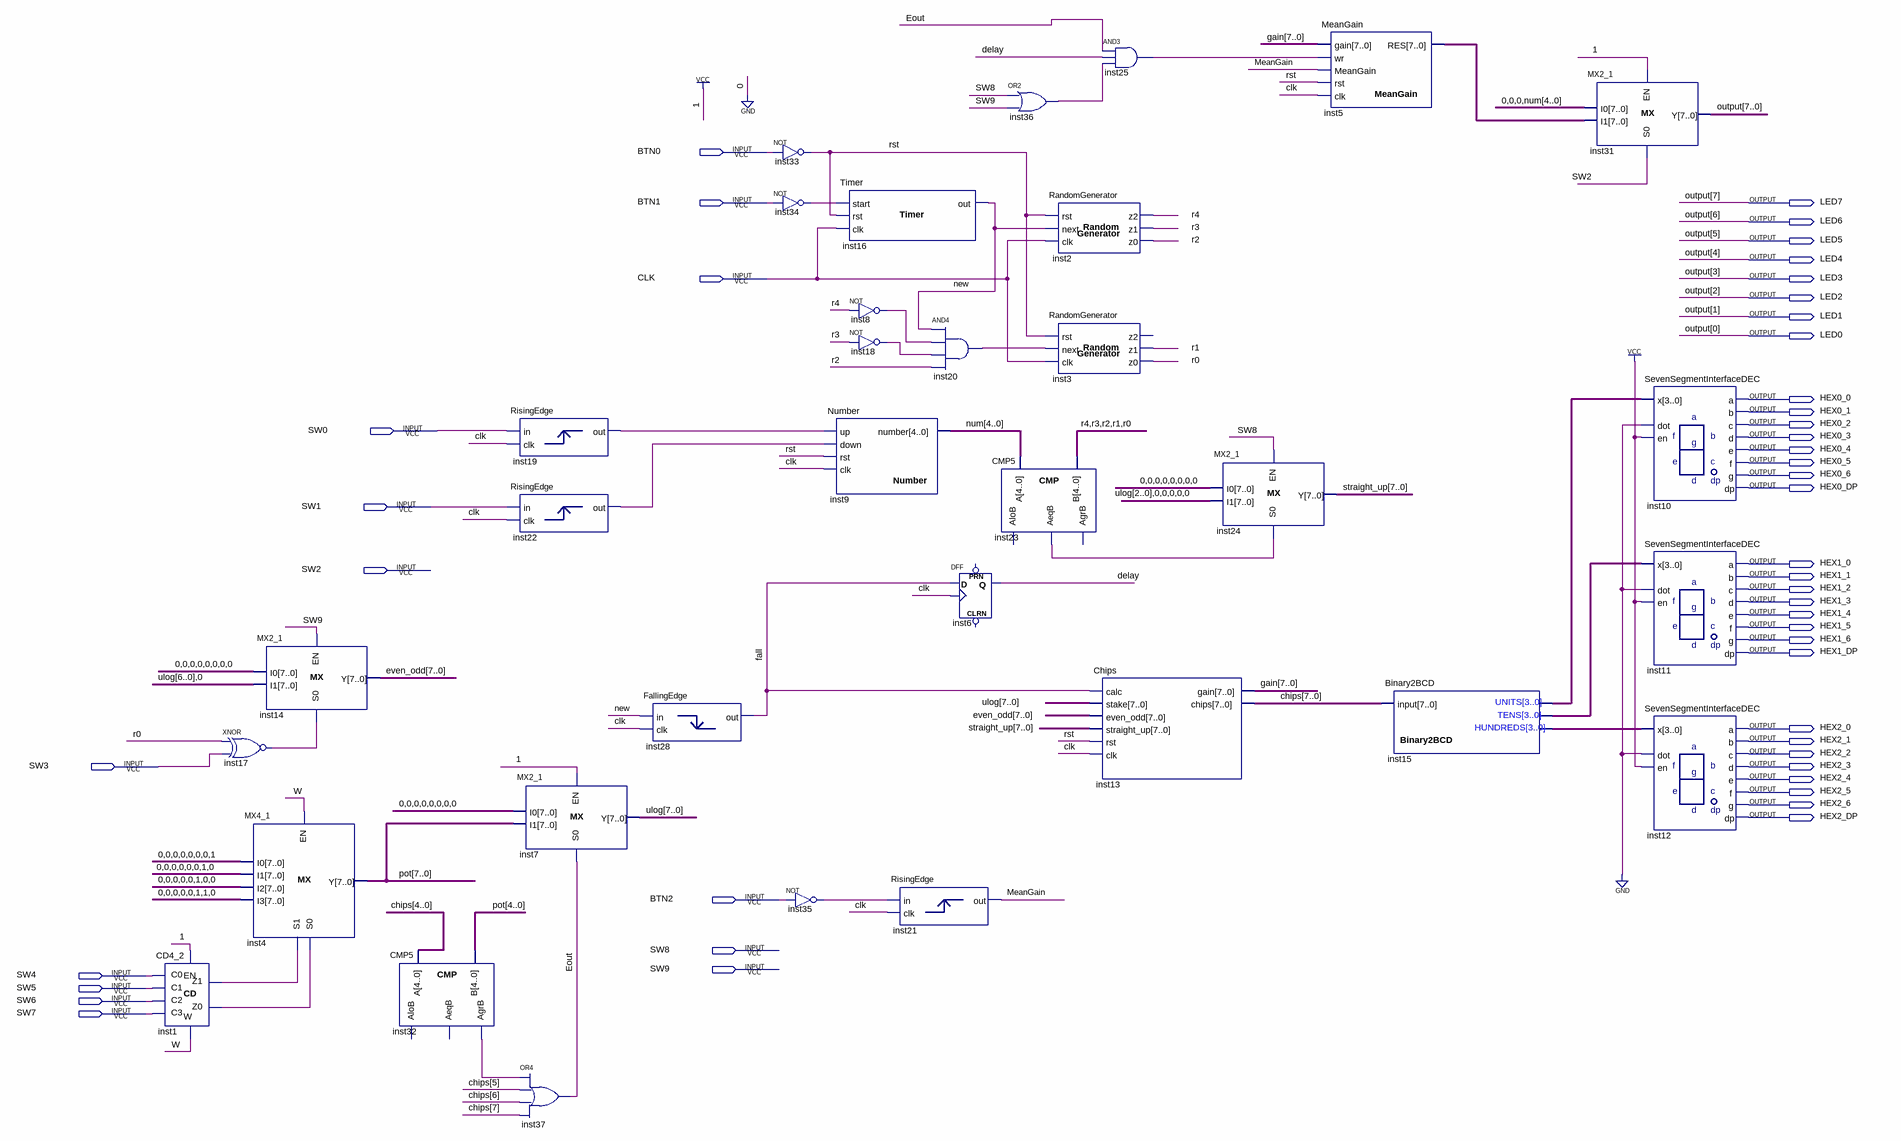
[diagram p0: schematic sheet]
// Quartus schematic PORT_LAB5.bdf as structural Verilog: 33 symbols, 46 pins
module PORT_LAB5 (
  input  BTN0,
  input  BTN1,
  input  CLK,
  input  SW0,
  input  SW1,
  input  SW2,
  input  SW3,
  input  BTN2,
  input  SW8,
  input  SW9,
  input  SW4,
  input  SW5,
  input  SW6,
  input  SW7,
  output LED7,
  output LED6,
  output LED5,
  output LED4,
  output LED3,
  output LED2,
  output LED1,
  output LED0,
  output HEX0_0,
  output HEX0_1,
  output HEX0_2,
  output HEX0_3,
  output HEX0_4,
  output HEX0_5,
  output HEX0_6,
  output HEX0_DP,
  output HEX1_0,
  output HEX1_1,
  output HEX1_2,
  output HEX1_3,
  output HEX1_4,
  output HEX1_5,
  output HEX1_6,
  output HEX1_DP,
  output HEX2_0,
  output HEX2_1,
  output HEX2_2,
  output HEX2_3,
  output HEX2_4,
  output HEX2_5,
  output HEX2_6,
  output HEX2_DP
);

  wire delay, Eout, fall, inst1_z0, inst1_z1, inst8_out, inst17_out, inst18_out, inst19_output, inst20_out,
       inst22_output, inst23_aeqb, inst25_out, inst32_agrb, inst34_out, inst35_out, inst36_out, MeanGain,
       \new , r0, r1, r2, r3, r4, rst, W;
  wire [3:0] inst15_bcd_hundreds, inst15_bcd_tens, inst15_bcd_units;
  wire [4:0] num;
  wire [7:0] chips, even_odd, gain, inst5_res, pot, straight_up, ulog;

  CD4_2 inst1 (.C0(SW4), .C1(SW5), .C2(SW6), .C3(SW7), .EN(1'b1), .Z0(inst1_z0), .Z1(inst1_z1), .W(W));
  xnor inst17 (inst17_out, r0, SW3);
  MX2_1 inst14 (.I1({ulog[6:0], 1'b0}), .I0({8{1'b0}}), .S0(inst17_out), .EN(SW9), .Y(even_odd));
  MX4_1 inst4 (
    .I3(8'b00000110), .I2(8'b00000100), .I1(8'b00000010), .I0(8'b00000001), .S1(inst1_z1), .S0(inst1_z0),
    .EN(W), .Y(pot));
  CMP5 inst32 (.A(chips[4:0]), .B(pot[4:0]), .AgrB(inst32_agrb));  // open: AeqB, AloB
  RisingEdge inst19 (.clk(CLK), .\input (SW0), .\output (inst19_output));
  RisingEdge inst22 (.clk(CLK), .\input (SW1), .\output (inst22_output));
  MX2_1 inst7 (.I1(pot), .I0({8{1'b0}}), .S0(Eout), .EN(1'b1), .Y(ulog));
  or inst37 (Eout, inst32_agrb, chips[5], chips[6], chips[7]);
  FallingEdge inst28 (.clk(CLK), .\input (\new ), .\output (fall));
  not inst33 (rst, BTN0);
  not inst34 (inst34_out, BTN1);
  not inst35 (inst35_out, BTN2);
  Timer inst16 (.start(inst34_out), .rst(rst), .clk(CLK), .out(\new ));
  Number inst9 (.up(inst19_output), .down(inst22_output), .rst(rst), .clk(CLK), .number(num));
  not inst8 (inst8_out, r4);
  not inst18 (inst18_out, r3);
  RisingEdge inst21 (.clk(CLK), .\input (inst35_out), .\output (MeanGain));
  and inst20 (inst20_out, \new , inst8_out, inst18_out, r2);
  CMP5 inst23 (.A(num), .B({r4, r3, r2, r1, r0}), .AeqB(inst23_aeqb));  // open: AgrB, AloB
  DFF inst6 (.CLK(CLK), .D(fall), .Q(delay));  // open: CLRN, PRN
  or inst36 (inst36_out, SW8, SW9);
  RandomGenerator inst2 (.NXT(\new ), .RST(rst), .CLK(CLK), .Z2(r4), .Z1(r3), .Z0(r2));
  RandomGenerator inst3 (.NXT(inst20_out), .RST(rst), .CLK(CLK), .Z1(r1), .Z0(r0));  // open: Z2
  Chips inst13 (
    .calc(fall), .stake(ulog), .even_odd(even_odd), .straight_up(straight_up), .rst(rst), .clk(CLK),
    .gain(gain), .chips(chips));
  and inst25 (inst25_out, Eout, delay, inst36_out);
  MX2_1 inst24 (.I1({ulog[2:0], {5{1'b0}}}), .I0({8{1'b0}}), .S0(inst23_aeqb), .EN(SW8), .Y(straight_up));
  MeanGain inst5 (.gain(gain), .wr(inst25_out), .MeanGain(MeanGain), .rst(rst), .clk(CLK), .RES(inst5_res));
  Binary2BCD inst15 (
    .\input (chips), .bcd_hundreds(inst15_bcd_hundreds), .bcd_tens(inst15_bcd_tens),
    .bcd_units(inst15_bcd_units));
  MX2_1 inst31 (
    .I1(inst5_res), .I0({3'b000, num}), .S0(SW2), .EN(1'b1),
    .Y({LED7, LED6, LED5, LED4, LED3, LED2, LED1, LED0}));
  SevenSegmentInterfaceDEC inst10 (
    .dot(1'b0), .en(1'b1), .x(inst15_bcd_units), .a(HEX0_0), .b(HEX0_1), .c(HEX0_2), .d(HEX0_3), .e(HEX0_4),
    .f(HEX0_5), .g(HEX0_6), .dp(HEX0_DP));
  SevenSegmentInterfaceDEC inst11 (
    .dot(1'b0), .en(1'b1), .x(inst15_bcd_tens), .a(HEX1_0), .b(HEX1_1), .c(HEX1_2), .d(HEX1_3), .e(HEX1_4),
    .f(HEX1_5), .g(HEX1_6), .dp(HEX1_DP));
  SevenSegmentInterfaceDEC inst12 (
    .dot(1'b0), .en(1'b1), .x(inst15_bcd_hundreds), .a(HEX2_0), .b(HEX2_1), .c(HEX2_2), .d(HEX2_3),
    .e(HEX2_4), .f(HEX2_5), .g(HEX2_6), .dp(HEX2_DP));

  // Other names for the same wires on the sheet: output[7:0] = {LED7, LED6, LED5, LED4, LED3, LED2, LED1, LED0}
endmodule
